# Altium schematic sheet Solar.SchDoc: =ProjectName
size A4; CheckedBy: DatNB; Author: Ven; CompanyName: Nacentech; Organization: IMET
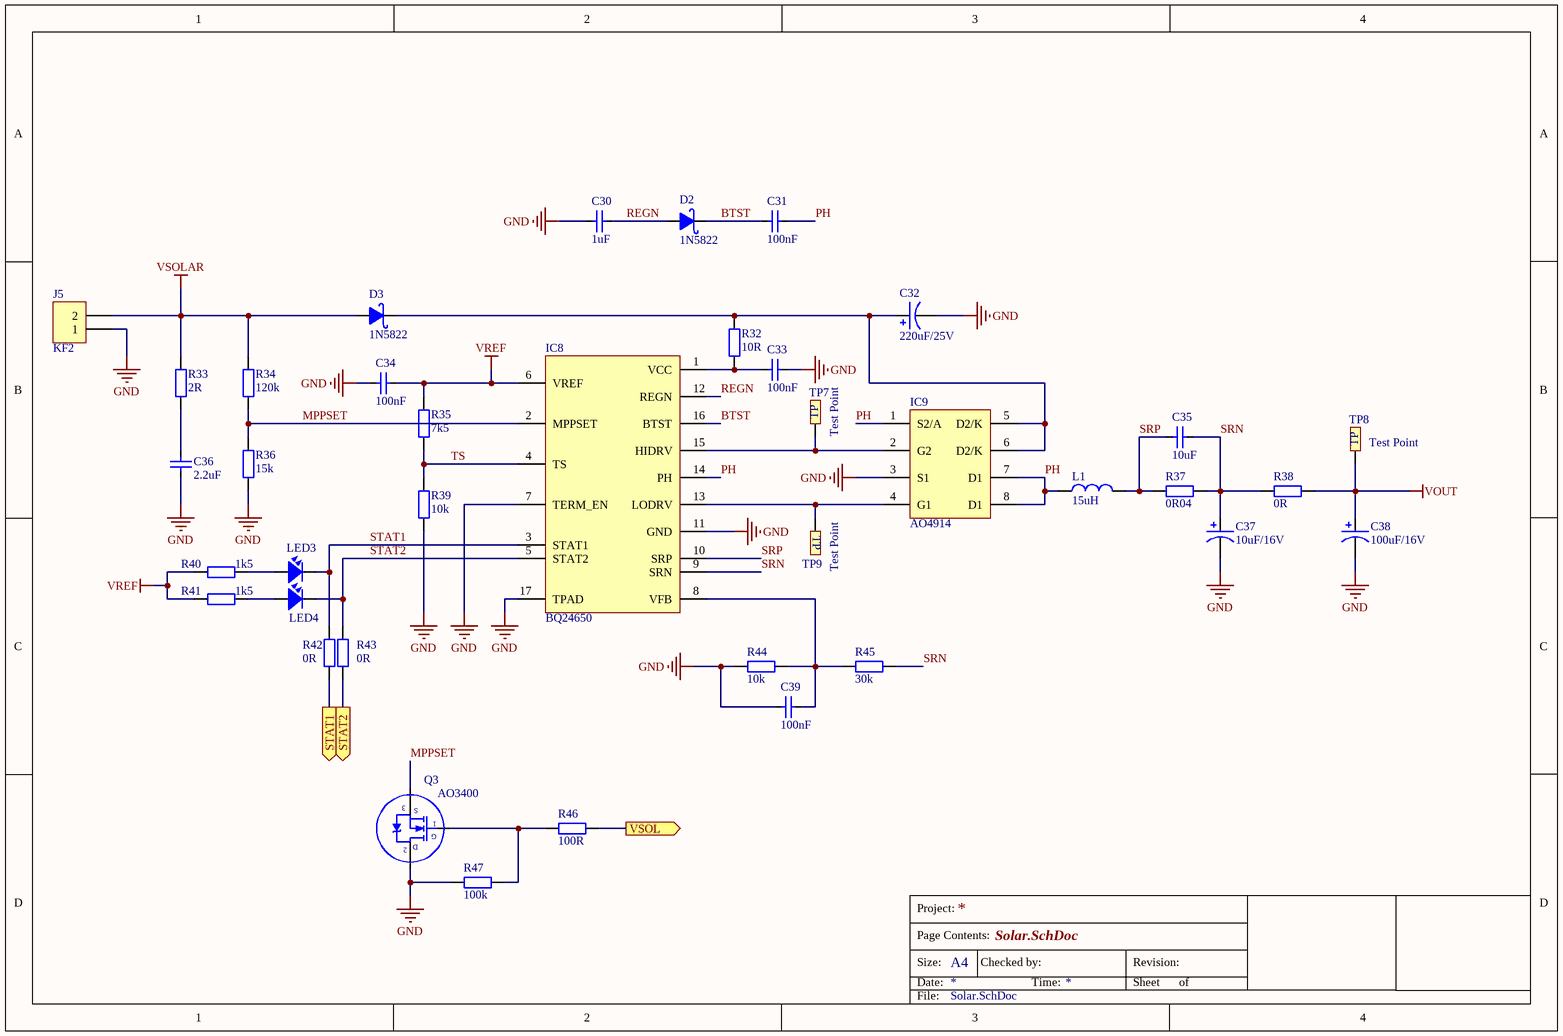
[diagram p0: Solar.SchDoc]

## Parts
C30  1uF  [CAP_0805]
C31  100nF  [CAP_0805]
C32  220uF/25V  [C5mm]
C33  100nF  [CAP_0805]
C34  100nF  [CAP_0805]
C35  10uF  [CAP_0805]
C36  2.2uF  [CAP_0805]
C37  10uF/16V  [C5mm]
C38  100uF/16V  [C5mm]
C39  100nF  [CAP_0805]
D2  1N5822  [DIO-214AC(SMA)]
D3  1N5822  [DIO-214AC(SMA)]
IC8  BQ24650  [VQFN-16]
IC9  AO4914  [SOIC-8]
J5  KF2  [KF2-5.08]
L1  15uH  [L-SMD-M-7.3x4.5]
LED3  LED  [LED-0805-Red]  (value not drawn)
LED4  LED  [LED-0805-Orange]  (value not drawn)
Q3  AO3400  [SOT23A]
R32  10R  [RES-SMD-0805]
R33  2R  [RES-SMD-0805]
R34  120k  [RES-SMD-0805]
R35  7k5  [RES-SMD-0805]
R36  15k  [RES-SMD-0805]
R37  0R04  [RES-SMD-2512]
R38  0R  [RES-SMD-2512]
R39  10k  [RES-SMD-0805]
R40  1k5  [RES-SMD-0805]
R41  1k5  [RES-SMD-0805]
R42  0R  [RES-SMD-0805]
R43  0R  [RES-SMD-0805]
R44  10k  [RES-SMD-0805]
R45  30k  [RES-SMD-0805]
R46  100R  [RES-SMD-0805]
R47  100k  [RES-SMD-0805]
TP7  Test Point  [TP_SMD]
TP8  Test Point  [TP_SMD]
TP9  Test Point  [TP_SMD]

## Ports
STAT1 (out), STAT2 (out), VSOL (out)

## Nets
GND: C30.2 C32.2 C33.2 C34.2 C36.1 C37.2 C38.2 C39.1 IC8.7(TERM_EN) IC8.11(GND) IC8.17(TPAD) IC9.3(S1) J5.1 Q3.2(D) R36.2 R39.1 R44.1 R47.2
VOUT: C38.1 R38.2 TP8.1
VREF: C34.1 IC8.6(VREF) R35.1 R40.1 R41.1
VSOLAR: D3.1(A) J5.2 R33.1 R34.2
BTST: C31.1 D2.2(K) IC8.16(BTST)
MPPSET: IC8.2(MPPSET) Q3.3(S) R34.1 R36.1
PH: C31.2 IC8.14(PH) IC9.1(S2/A) IC9.7(D1) IC9.8(D1) L1.1
REGN: C30.1 D2.1(A) IC8.12(REGN)
SRN: C35.1 C37.1 IC8.9(SRN) R37.2 R38.1 R45.1
SRP: C35.2 IC8.10(SRP) L1.2 R37.1
STAT1: IC8.3(STAT1) LED3.2 R42.2
STAT1: R42.1 ; port STAT1  [a separate net that carries the same name]
STAT2: IC8.5(STAT2) LED4.2 R43.2
STAT2: R43.1 ; port STAT2  [a separate net that carries the same name]
TS: IC8.4(TS) R35.2 R39.2
VSOL: R46.2 ; port VSOL
NetC32_1: C32.1 D3.2(K) IC9.5(D2/K) IC9.6(D2/K) R32.1
NetC33_1: C33.1 IC8.1(VCC) R32.2
NetC36_2: C36.2 R33.2
NetC39_2: C39.2 IC8.8(VFB) R44.2 R45.2
NetIC8_13: IC8.13(LODRV) IC9.4(G1) TP9.1
NetIC8_15: IC8.15(HIDRV) IC9.2(G2) TP7.1
NetLED3_1: LED3.1 R40.2
NetLED4_1: LED4.1 R41.2
NetQ3_1: Q3.1(G) R46.1 R47.1

## Notes on the sheet
- Project:
- Page Contents:
- Size:
- Date:
- A4
- Checked by:
- Time:
- Revision:
- Sheet
- of
- File:

## Library data of the parts
C30 C31 C33-C36 C39 = CapSMD: Capacitor; Value: 33p; Published: 8-Jun-2000; LatestRevisionDate: 17-Jul-2002; LatestRevisionNote: Re-released for DXP Platform.; PackageReference: RAD-0.3; Publisher: Altium Limited
C32 C37 C38 = Cap Pol: Polarized Capacitor (Axial); Published: 8-Jun-2000; LatestRevisionDate: 17-Jul-2002; LatestRevisionNote: Re-released for DXP Platform.; PackageReference: POLAR0.8; Publisher: Altium Limited
D2 D3 = 1N5822: Schottky Rectifiers; Value: Diode c?m 1N5408
IC8 = BQ24650: BQ24650 Stand-Alone Synchronous Buck Battery Charge Controller for Solar Power / With Maximum Power Point Tracking
IC9 = AO4914: Dual N-Channel Enhancement Mode Field Effect Transistor with Schottky Diode
J5 = KF2: Manufacturer: Würth Elektronik eiSos GmbH; partNo: 691103110002; ComponentLink1 Description: Manufacturer; ComponentLink2 Description: Datasheet; NoPins: 2; Created Date: 29 October 2013; ComponentLink1URL: http://www.we-online.com; ComponentLink2URL: http://katalog.we-online.de/em/datasheet/6911031100xx.pdf; Created by: Karrer Zheng
L1 = Inductor: Value: 150 mH
LED3 LED4 = LED: LED Single colour Green and Red; Value: LED 3 ly Single Colour
Q3 = MOSFET_N: Generic N Channel MOSFET
R32-R47 = Resistor - SMD: Resistor SMD; Manufacturer: Generic Components; Class: Passive; Published: 08/06/2000; Publisher: Altium Hobart Technology Centre
TP7-TP9 = TP: CONNECT 1